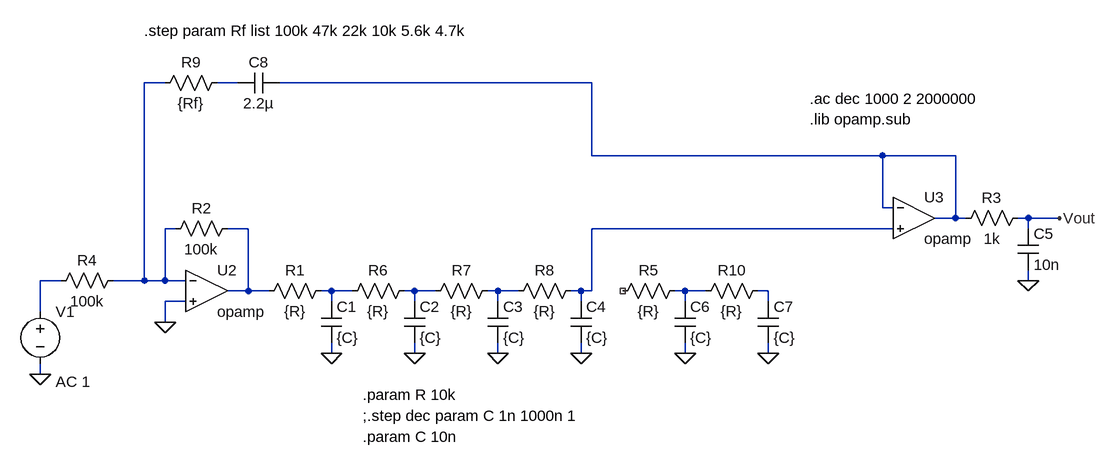
[diagram p0: schematic low-pass with feedback unbuffered.asc]
low-pass with feedback unbuffered.asc, the LTspice schematic file:
Version 4
SHEET 1 1952 1652
WIRE -240 496 -272 496
WIRE -128 496 -160 496
WIRE 416 496 -64 496
WIRE 416 608 416 496
WIRE 864 608 416 608
WIRE 976 608 864 608
WIRE 864 688 864 608
WIRE 880 688 864 688
WIRE 976 704 976 608
WIRE 976 704 944 704
WIRE 992 704 976 704
WIRE 1088 704 1072 704
WIRE 1136 704 1088 704
WIRE -224 720 -240 720
WIRE -112 720 -144 720
WIRE 880 720 416 720
WIRE 1088 720 1088 704
WIRE -400 800 -432 800
WIRE -272 800 -272 496
WIRE -272 800 -320 800
WIRE -240 800 -240 720
WIRE -240 800 -272 800
WIRE -208 800 -240 800
WIRE 1088 800 1088 784
WIRE -112 816 -112 720
WIRE -112 816 -144 816
WIRE -80 816 -112 816
WIRE 16 816 0 816
WIRE 48 816 16 816
WIRE 144 816 128 816
WIRE 176 816 144 816
WIRE 272 816 256 816
WIRE 304 816 272 816
WIRE 400 816 384 816
WIRE 416 816 416 720
WIRE 416 816 400 816
WIRE 560 816 544 816
WIRE 592 816 560 816
WIRE 688 816 672 816
WIRE -208 832 -240 832
WIRE 16 832 16 816
WIRE 144 832 144 816
WIRE 272 832 272 816
WIRE 400 832 400 816
WIRE 560 832 560 816
WIRE 688 832 688 816
WIRE -432 848 -432 800
WIRE -240 864 -240 832
WIRE 16 912 16 896
WIRE 144 912 144 896
WIRE 272 912 272 896
WIRE 400 912 400 896
WIRE 560 912 560 896
WIRE 688 912 688 896
WIRE -432 944 -432 928
FLAG 16 912 0
FLAG -432 944 0
FLAG 1136 704 Vout
FLAG -240 864 0
FLAG 144 912 0
FLAG 272 912 0
FLAG 400 912 0
FLAG 1088 800 0
FLAG 560 912 0
FLAG 688 912 0
SYMBOL cap 0 832 R0
SYMATTR InstName C1
SYMATTR Value {C}
SYMBOL res -96 832 R270
WINDOW 0 32 56 VTop 2
WINDOW 3 0 56 VBottom 2
SYMATTR InstName R1
SYMATTR Value {R}
SYMBOL voltage -432 832 R0
WINDOW 123 24 124 Left 2
WINDOW 39 0 0 Left 2
SYMATTR Value2 AC 1
SYMATTR InstName V1
SYMATTR Value ""
SYMBOL Opamps\\opamp -176 752 R0
SYMATTR InstName U2
SYMBOL res -416 816 R270
WINDOW 0 32 56 VTop 2
WINDOW 3 0 56 VBottom 2
SYMATTR InstName R4
SYMATTR Value 100k
SYMBOL res -240 736 R270
WINDOW 0 32 56 VTop 2
WINDOW 3 0 56 VBottom 2
SYMATTR InstName R2
SYMATTR Value 100k
SYMBOL Opamps\\opamp 912 640 R0
SYMATTR InstName U3
SYMBOL res -256 512 R270
WINDOW 0 32 56 VTop 2
WINDOW 3 0 56 VBottom 2
SYMATTR InstName R9
SYMATTR Value {Rf}
SYMBOL cap 128 832 R0
SYMATTR InstName C2
SYMATTR Value {C}
SYMBOL res 32 832 R270
WINDOW 0 32 56 VTop 2
WINDOW 3 0 56 VBottom 2
SYMATTR InstName R6
SYMATTR Value {R}
SYMBOL cap 256 832 R0
SYMATTR InstName C3
SYMATTR Value {C}
SYMBOL res 160 832 R270
WINDOW 0 32 56 VTop 2
WINDOW 3 0 56 VBottom 2
SYMATTR InstName R7
SYMATTR Value {R}
SYMBOL cap 384 832 R0
SYMATTR InstName C4
SYMATTR Value {C}
SYMBOL res 288 832 R270
WINDOW 0 32 56 VTop 2
WINDOW 3 0 56 VBottom 2
SYMATTR InstName R8
SYMATTR Value {R}
SYMBOL cap 1072 720 R0
SYMATTR InstName C5
SYMATTR Value 10n
SYMBOL res 976 720 R270
WINDOW 0 32 56 VTop 2
WINDOW 3 0 56 VBottom 2
SYMATTR InstName R3
SYMATTR Value 1k
SYMBOL cap 544 832 R0
SYMATTR InstName C6
SYMATTR Value {C}
SYMBOL res 448 832 R270
WINDOW 0 32 56 VTop 2
WINDOW 3 0 56 VBottom 2
SYMATTR InstName R5
SYMATTR Value {R}
SYMBOL cap 672 832 R0
SYMATTR InstName C7
SYMATTR Value {C}
SYMBOL res 576 832 R270
WINDOW 0 32 56 VTop 2
WINDOW 3 0 56 VBottom 2
SYMATTR InstName R10
SYMATTR Value {R}
SYMBOL cap -64 480 R90
WINDOW 0 0 32 VBottom 2
WINDOW 3 32 32 VTop 2
SYMATTR InstName C8
SYMATTR Value 2.2µ
TEXT 752 552 Left 2 !.lib opamp.sub
TEXT 752 520 Left 2 !.ac dec 1000 2 2000000
TEXT -272 416 Left 2 !.step param Rf list 100k 47k 22k 10k 5.6k 4.7k
TEXT 64 976 Left 2 !.param R 10k
TEXT 64 1008 Left 2 !;.step dec param C 1n 1000n 1
TEXT 64 1040 Left 2 !.param C 10n

The netlist it stands for:
* low-pass with feedback unbuffered.asc
C1 N007 0 {C}
R1 N004 N007 {R}
V1 N006 0 AC 1
XU2 N001 0 N004 opamp Aol=100K GBW=10Meg  ; pins invin noninvin out
R4 N006 N001 100k
R2 N001 N004 100k
XU3 N003 N005 N003 opamp Aol=100K GBW=10Meg  ; pins invin noninvin out
R9 N001 N002 {Rf}
C2 N008 0 {C}
R6 N007 N008 {R}
C3 N009 0 {C}
R7 N008 N009 {R}
C4 N005 0 {C}
R8 N009 N005 {R}
C5 Vout 0 10n
R3 N003 Vout 1k
C6 N010 0 {C}
R5 NC_01 N010 {R}
C7 N011 0 {C}
R10 N010 N011 {R}
C8 N003 N002 2.2µ
.lib opamp.sub
.ac dec 1000 2 2000000
.step param Rf list 100k 47k 22k 10k 5.6k 4.7k
.param R 10k
;.step dec param C 1n 1000n 1
.param C 10n
.backanno
.end